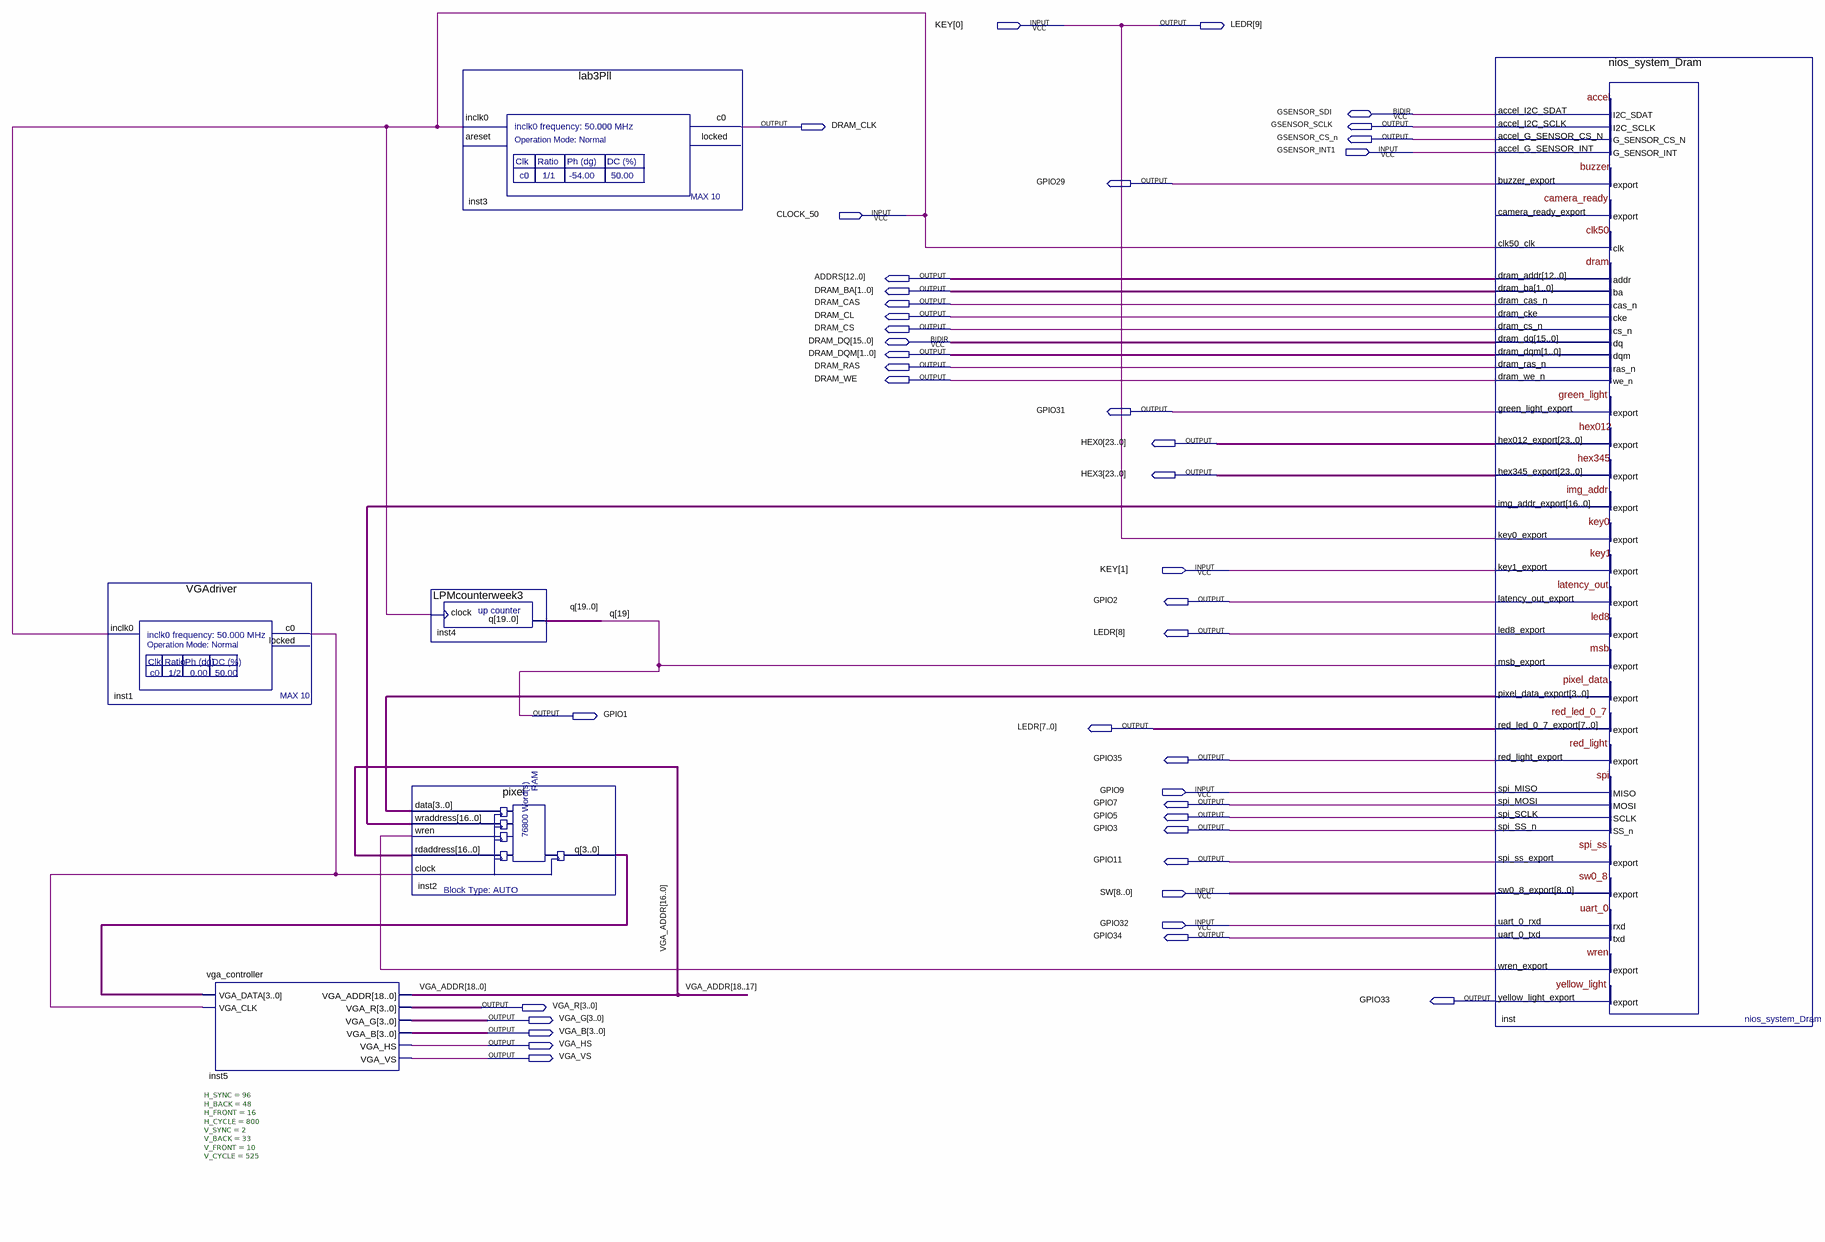
[diagram p0: schematic sheet]
// Quartus schematic ECE3073_Lab3.bdf as structural Verilog: 6 symbols, 41 pins
module ECE3073_Lab3 (
  input  [1:0] KEY,
  input  GSENSOR_INT1,
  input  CLOCK_50,
  input  GPIO9,
  input  [8:0] SW,
  input  GPIO32,
  inout  GSENSOR_SDI,
  inout  [15:0] DRAM_DQ,
  output [9:0] LEDR,
  output DRAM_CLK,
  output GSENSOR_SCLK,
  output GSENSOR_CS_n,
  output GPIO29,
  output [12:0] ADDRS,
  output [1:0] DRAM_BA,
  output DRAM_CAS,
  output DRAM_CL,
  output DRAM_CS,
  output [1:0] DRAM_DQM,
  output DRAM_RAS,
  output DRAM_WE,
  output GPIO31,
  output [23:0] HEX0,
  output [23:0] HEX3,
  output GPIO2,
  output GPIO1,
  output GPIO35,
  output GPIO7,
  output GPIO5,
  output GPIO3,
  output GPIO11,
  output GPIO34,
  output GPIO33,
  output [3:0] VGA_R,
  output [3:0] VGA_G,
  output [3:0] VGA_B,
  output VGA_HS,
  output VGA_VS
);

  wire inst1_c0, inst_wren_export;
  wire [3:0] inst2_q, inst_pixel_data_export;
  wire [16:0] inst_img_addr_export;
  wire [18:0] q, VGA_ADDR;

  VGAdriver inst1 (.inclk0(CLOCK_50), .c0(inst1_c0));  // open: locked
  vga_controller #(.H_SYNC(96), .H_BACK(48), .H_FRONT(16), .H_CYCLE(800), .V_SYNC(2), .V_BACK(33), .V_FRONT(10), .V_CYCLE(525)) inst5 (
    .VGA_DATA(inst2_q), .VGA_CLK(inst1_c0), .VGA_ADDR(VGA_ADDR), .VGA_R(VGA_R), .VGA_G(VGA_G), .VGA_B(VGA_B),
    .VGA_HS(VGA_HS), .VGA_VS(VGA_VS));
  LPMcounterweek3 inst4 (.clock(CLOCK_50), .q({GPIO1, q}));
  pixel inst2 (
    .data(inst_pixel_data_export), .wraddress(inst_img_addr_export), .wren(inst_wren_export),
    .rdaddress(VGA_ADDR[16:0]), .clock(inst1_c0), .q(inst2_q));
  lab3Pll inst3 (.inclk0(CLOCK_50), .c0(DRAM_CLK));  // open: areset, locked
  nios_system_Dram inst (
    .accel_G_SENSOR_INT(GSENSOR_INT1), .clk50_clk(CLOCK_50), .key0_export(KEY[0]), .key1_export(KEY[1]),
    .msb_export(GPIO1), .spi_MISO(GPIO9), .sw0_8_export(SW), .uart_0_rxd(GPIO32),
    .accel_I2C_SCLK(GSENSOR_SCLK), .accel_G_SENSOR_CS_N(GSENSOR_CS_n), .buzzer_export(GPIO29),
    .dram_addr(ADDRS), .dram_ba(DRAM_BA), .dram_cas_n(DRAM_CAS), .dram_cke(DRAM_CL), .dram_cs_n(DRAM_CS),
    .dram_dqm(DRAM_DQM), .dram_ras_n(DRAM_RAS), .dram_we_n(DRAM_WE), .green_light_export(GPIO31),
    .hex012_export(HEX0), .hex345_export(HEX3), .img_addr_export(inst_img_addr_export),
    .latency_out_export(GPIO2), .led8_export(LEDR[8]), .pixel_data_export(inst_pixel_data_export),
    .red_led_0_7_export(LEDR[7:0]), .red_light_export(GPIO35), .spi_MOSI(GPIO7), .spi_SCLK(GPIO5),
    .spi_SS_n(GPIO3), .spi_ss_export(GPIO11), .uart_0_txd(GPIO34), .wren_export(inst_wren_export),
    .yellow_light_export(GPIO33), .accel_I2C_SDAT(GSENSOR_SDI), .dram_dq(DRAM_DQ));  // open: camera_ready_export

  assign LEDR[9] = KEY[0];

  // Other names for the same wires on the sheet: q[19] = GPIO1
endmodule
